# Altium project CPC-UNIFEI.PrjPcb (part 4 of 4)

## Sheet STM32_CONNECTORS.SchDoc
size A4; SheetNumber: 14; SheetTotal: 14
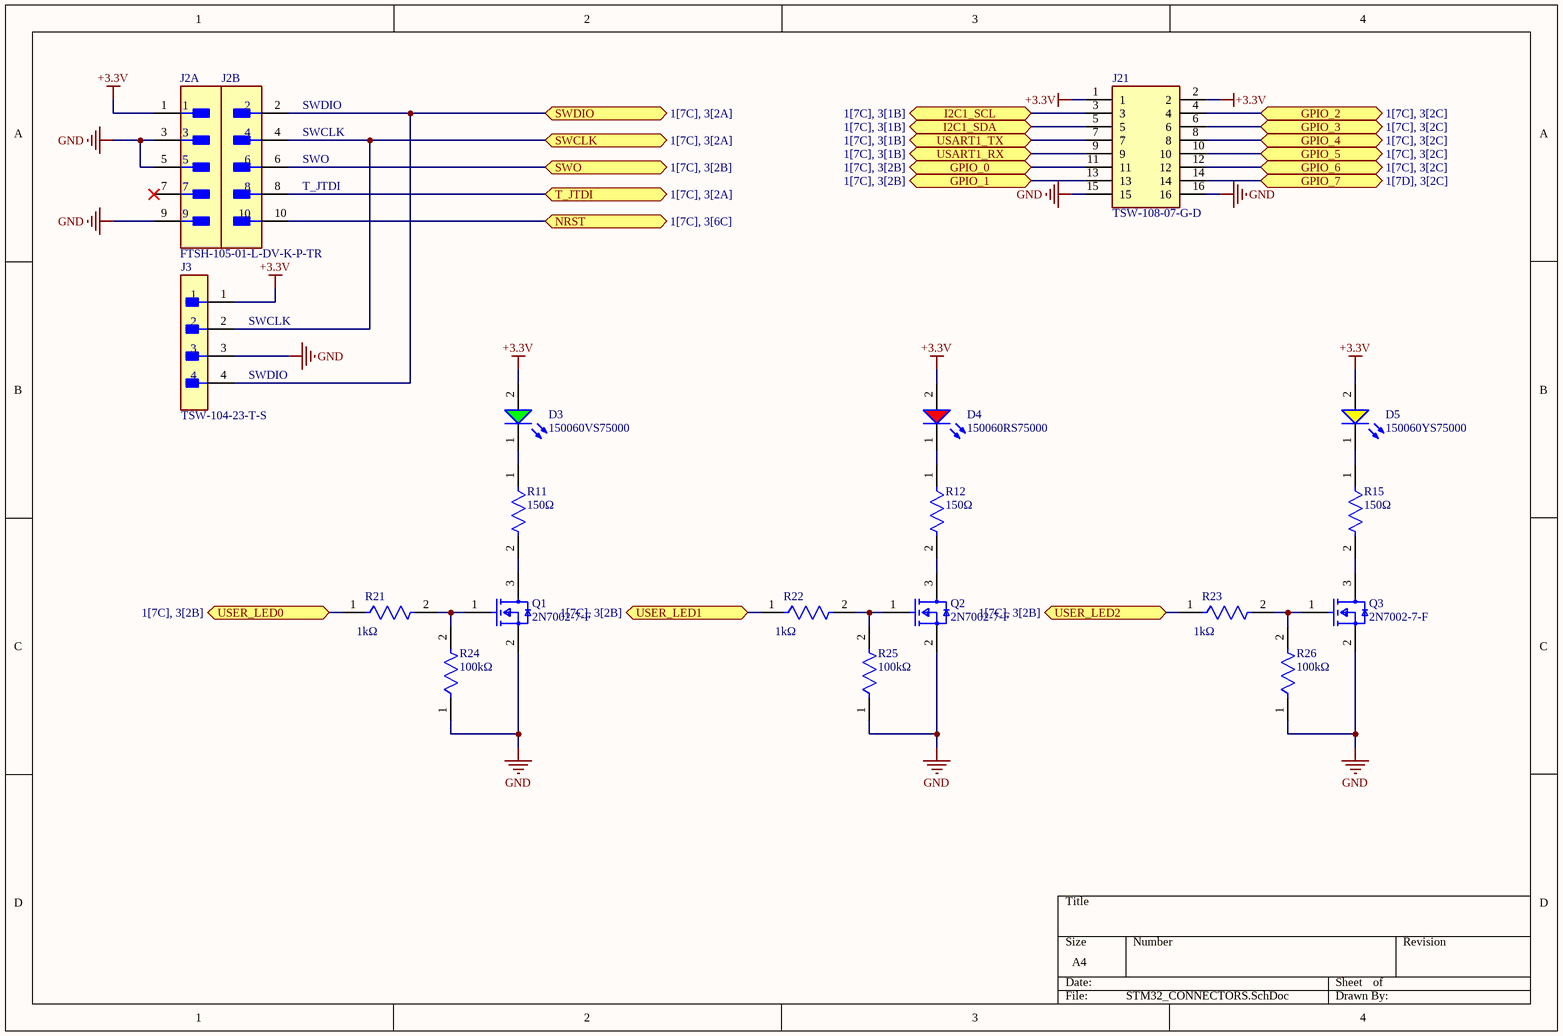
[diagram p13: STM32_CONNECTORS.SchDoc]

### Parts
D3  150060VS75000  [WL-SMCW_0603_150060xx75000]
D4  150060RS75000  [WL-SMCW_0603_150060xx75000]
D5  150060YS75000  [WL-SMCW_0603_150060xx75000]
J2  FTSH-105-01-L-DV-K-P-TR  [FP-FTSH-105-01-L-DV-K-P-T-MFG]  (parts A,B of 2)
J3  TSW-104-23-T-S  [FP-TSW-104-23-T-S-MFG]
J21  TSW-108-07-G-D  [HDRV16W64P254_2X8_2032X508X838P]
Q1  2N7002-7-F  [FP-SOT23-IPC_A]
Q2  2N7002-7-F  [FP-SOT23-IPC_A]
Q3  2N7002-7-F  [FP-SOT23-IPC_A]
R11  Resistance: 150Ω  [FP-CRCW0603-e3-IPC_B]  (hidden comment: CRCW0603150RFKEA)
R12  Resistance: 150Ω  [FP-CRCW0603-e3-IPC_B]  (hidden comment: CRCW0603150RFKEA)
R15  Resistance: 150Ω  [FP-CRCW0603-e3-IPC_B]  (hidden comment: CRCW0603150RFKEA)
R21  Resistance: 1kΩ  [FP-AC0603-IPC_B]  (hidden comment: AC0603FR-071KL)
R22  Resistance: 1kΩ  [FP-AC0603-IPC_B]  (hidden comment: AC0603FR-071KL)
R23  Resistance: 1kΩ  [FP-AC0603-IPC_B]  (hidden comment: AC0603FR-071KL)
R24  Resistance: 100kΩ  [FP-CRCW0603-e3-IPC_B]  (hidden comment: CRCW0603100KFKEC)
R25  Resistance: 100kΩ  [FP-CRCW0603-e3-IPC_B]  (hidden comment: CRCW0603100KFKEC)
R26  Resistance: 100kΩ  [FP-CRCW0603-e3-IPC_B]  (hidden comment: CRCW0603100KFKEC)

### Ports
GPIO_0 (bidir, see 1[7C], 3[2B]), GPIO_1 (bidir, see 1[7C], 3[2B]), GPIO_2 (bidir, see 1[7C], 3[2C]), GPIO_3 (bidir, see 1[7C], 3[2C]), GPIO_4 (bidir, see 1[7C], 3[2C]), GPIO_5 (bidir, see 1[7C], 3[2C]), GPIO_6 (bidir, see 1[7C], 3[2C]), GPIO_7 (bidir, see 1[7D], 3[2C]), I2C1_SCL (bidir, see 1[7C], 3[1B]), I2C1_SDA (bidir, see 1[7C], 3[1B]), NRST (bidir, see 1[7C], 3[6C]), SWCLK (bidir, see 1[7C], 3[2A]), SWDIO (bidir, see 1[7C], 3[2A]), SWO (bidir, see 1[7C], 3[2B]), T_JTDI (bidir, see 1[7C], 3[2A]), USART1_RX (bidir, see 1[7C], 3[1B]), USART1_TX (bidir, see 1[7C], 3[1B]), USER_LED0 (bidir, see 1[7C], 3[2B]), USER_LED1 (bidir, see 1[7C], 3[2B]), USER_LED2 (bidir, see 1[7C], 3[2B])

### Nets
+3.3V: D3.2(A) D4.2(A) D5.2(A) J2.1 J3.1 J21.1 J21.2
GND: J2.3 J2.5 J2.9 J3.3 J21.15 J21.16 Q1.2(S) Q2.2(S) Q3.2(S) R24.1 R25.1 R26.1
NRST: J2.10 ; port NRST
PA13: J2.2 J3.4 ; port SWDIO
PA14: J2.4 J3.2 ; port SWCLK
PA15: J2.8 ; port T_JTDI
PB0: R21.1 ; port USER_LED0
PB1: R22.1 ; port USER_LED1
PB2: R23.1 ; port USER_LED2
PB3: J2.6 ; port SWO
PB6: J21.3 ; port I2C1_SCL
PB7: J21.5 ; port I2C1_SDA
PB8: J21.11 ; port GPIO_0
PB9: J21.13 ; port GPIO_1
PB14: J21.7 ; port USART1_TX
PB15: J21.9 ; port USART1_RX
PE0: J21.4 ; port GPIO_2
PE1: J21.6 ; port GPIO_3
PE2: J21.8 ; port GPIO_4
PE3: J21.10 ; port GPIO_5
PE4: J21.12 ; port GPIO_6
PE5: J21.14 ; port GPIO_7
NetD3_1: D3.1(K) R11.1
NetD4_1: D4.1(K) R12.1
NetD5_1: D5.1(K) R15.1
NetQ1_1: Q1.1(G) R21.2 R24.2
NetQ1_3: Q1.3(D) R11.2
NetQ2_1: Q2.1(G) R22.2 R25.2
NetQ2_3: Q2.3(D) R12.2
NetQ3_1: Q3.1(G) R23.2 R26.2
NetQ3_3: Q3.3(D) R15.2

Not connected (* = marked no-connect by the designer): J2 7*

### Notes on the sheet
- (near J2) SWDIO
- (near J2) SWCLK
- (near J2) SWO
- (near J2) T_JTDI
- (near J3) SWCLK
- (near J3) SWDIO

### Library data of the parts
D3 = CMP-1426-00006-6: as D14-D17 on sheet DIGITAL_OUTPUTS_BLOCK_A; Packaging: Tape and Reel; REACH SVHC: Unknown; Width: 800µm; Max Operating Temperature: 85°C; Number of Pins: 2; RoHS: Compliant; Dominant Wavelength: 570nm; Min Operating Temperature: -40°C; Case Code (Imperial): 0603; Height: 700µm; Length: 1.6mm; Case Code (Metric): 1608; Case/Package: 0603; Max Reverse Voltage (DC): 5V; Mount: Surface Mount
D4 = CMP-1426-00001-3: NexarPartId: 29717776; Color: Red; Power Dissipation: 72mW; Max Reverse Voltage (DC): 5V; Peak Wavelength: 630nm; Viewing Angle: 140°; Forward Voltage: 2V; Luminous Intensity: 250mcd; Forward Current: 100mA; Dominant Wavelength: 625nm; Lens Style: Clear, Rectangular; Max Junction Temperature (Tj): 95°C; Test Current: 20mA; Mount: Surface Mount; Packaging: Tape and Reel; Case Code (Metric): 1608; Max Operating Temperature: 85°C; Case Code (Imperial): 0603; REACH SVHC: Unknown; Width: 800µm; Length: 1.6mm; Reverse Voltage: 5V; Height: 700µm; Case/Package: 0603; RoHS: Compliant; Wavelength: 625nm; Min Operating Temperature: -40°C
D5 = CMP-1426-00005-2: NexarPartId: 29687085; Wavelength: 590nm; Luminous Intensity: 120mcd; Peak Wavelength: 595nm; Forward Current: 100mA; Power Dissipation: 72mW; Color: Yellow; Forward Voltage: 2V; Test Current: 20mA; Reverse Voltage: 5V; Lens Style: Clear, Rectangular; Max Junction Temperature (Tj): 95°C; Viewing Angle: 140°; Case Code (Imperial): 0603; Height: 700µm; REACH SVHC: Unknown; Dominant Wavelength: 590nm; Min Operating Temperature: -40°C; Width: 800µm; Mount: Surface Mount; Packaging: Tape and Reel; Max Operating Temperature: 85°C; RoHS: Compliant; Max Reverse Voltage (DC): 5V; Case Code (Metric): 1608; Length: 1.6mm; Case/Package: 0603
J2 = CMP-2000-06292-2: CONN HEADER SMD 10POS 1.27MM; Gender: Male; Max Current Rating: 1.75A; Number of Contacts: 10; Contact Material: Bronze; Pitch: 1.27mm; Contact Plating: Gold; Orientation: Straight; RoHS Compliant: Yes; Housing Material: Polymer; Housing Color: Black; Length: 6.35mm; Number of Rows: 2; Lead Free: Lead Free; Max Operating Temperature: 125°C; Min Operating Temperature: -55°C; Radiation Hardening: No; Termination: Solder; Depth: 5.84mm; Packaging: Tape and Reel
J3 = CMP-02766-001388-1: CONN HEADER VERT 4POS 2.54MM; Number of Contacts: 4; Gender: Male; Connector Type: Male Pin; Max Voltage Rating (AC): 550V; Max Current Rating: 7.6A; Radiation Hardening: No; Lead Free: Lead Free; RoHS Compliant: Yes; Contact Material: Bronze; Number of Positions: 4; Housing Color: Black; Min Operating Temperature: -55°C; Mount: Through Hole; Number of Rows: 1; Orientation: Straight; Contact Mating Length: 0.23inch; Contact Type: Male Pin; REACH SVHC: No SVHC; Max Operating Temperature: 105°C; Color: Black; Pitch: 2.54mm; Length: 10.16mm; Series: TSW; Packaging: Bulk; Contact Plating: Tin; Package Quantity: 1; Termination: Solder; Housing Material: Polyester; Width: 2.54mm; Depth: 2.54mm
J21 = TSW-108-07-G-D: Connector; Manufacturer_Name: SAMTEC; Datasheet Link: https://suddendocs.samtec.com/catalog_english/tsw_th.pdf?_gl=1*vxrzbc*_ga*MTk4NDk3MDkyNi4xNjgxOTY2Mjg5*_ga_3KFNZC07WW*MTY4MzYyNDMyNC4zLjEuMTY4MzYyNDM4NC42MC4wLjA.; Height: 8.38mm; Manufacturer_Part_Number: TSW-108-07-G-D; Mouser Part Number: 200-TSW10807GD; Mouser Price/Stock: https://www.mouser.co.uk/ProductDetail/Samtec/TSW-108-07-G-D?qs=jyzYFa4oMQg0kuHhXNXiwg%3D%3D; Arrow Part Number: TSW-108-07-G-D; Arrow Price/Stock: https://www.arrow.com/en/products/tsw-108-07-g-d/samtec?region=nac
Q1-Q3 = CMP-2000-04929-2: as Q6-Q9 on sheet DIGITAL_OUTPUTS_BLOCK_A; Termination: SMD/SMT; Weight: 0.000282oz; Radiation Hardening: No; Max Operating Temperature: 150°C; On-State Resistance: 7.5R; Mount: Surface Mount; Current Rating: 115mA; Contact Plating: Tin; Lead Free: Lead Free; Min Operating Temperature: -55°C; Number of Pins: 3; REACH SVHC: No SVHC; Drain to Source Voltage (Vdss): 60V; Width: 1.3mm; Package Quantity: 3000; Length: 2.9mm; Case/Package: SOT-23; Number of Channels: 1; Dual Supply Voltage: 60V; Packaging: Tape and Reel; Height: 1mm; Voltage Rating (DC): 60V; Nominal Vgs: 2.5V; Continuous Drain Current (ID): 115mA; Voltage: 60V; Rds On Max: 7.5R
R11 R12 R15 = CMP-2000-03913-2: RES Thick Film, 150Ω, 1%, 0.1W, 100ppm/°C, 0603; Voltage Rating (DC): 75V; Max Power Dissipation: 100mW; Features: Automotive AEC-Q200; Weight: 7.1E-05oz; Number of Terminations: 2; Temperature Coefficient: 100ppm/°C; Military Standard: Not; Length: 1.55mm; Min Operating Temperature: -55°C; Termination: SMD/SMT; Tolerance: 1%; Composition: Thick Film; Depth: 0.85mm; Max Operating Temperature: 155°C; Width: 0.033inch; Lead Free: Lead Free; Height: 0.45mm; Case Code (Metric): 1608; Package Quantity: 10; Case Code (Imperial): 0603; Voltage Rating: 75V; Radiation Hardening: No; Contact Plating: Tin; Mount: Surface Mount; Packaging: Tape and Reel; Power Rating: 100mW; Case/Package: 0603
R21-R23 = CMP-2000-04828-3: RES 1kΩ 1.00% 0.1W 0603; Voltage Rating: 50V; Power Rating: 100mW; Tolerance: 1%; Temperature Coefficient: 100ppm/°C; Depth: 0.8mm; Case/Package: 0603; Size Code: 0603; Case Code (Metric): 1608; Height: 0.022inch; Series: AC; Width: 0.031inch; Construction: Rectangular; Length: 0.063inch; Case Code (Imperial): 0603; Package Quantity: 1; RoHS Compliant: Yes; Features: Moisture Resistant; Resistor Type: Thick Film; Max Power Dissipation: 100mW; Packaging: Tape and Reel; Termination: SMD/SMT; Ratings: AEC-Q200; Max Operating Temperature: 155°C; Min Operating Temperature: -55°C; Military Standard: Not; Lead Free: Lead Free; Number of Terminations: 2
R24-R26 = CMP-2000-03822-2: RES Thick Film, 100kΩ, 1%, 0.1W, 100ppm/°C, 0603; Power Rating: 100mW; Height: 0.02inch; Min Operating Temperature: -55°C; Length: 0.061inch; Temperature Coefficient: 100ppm/°C; Number of Terminations: 2; Packaging: Tape and Reel; Case Code (Imperial): 0603; Case/Package: 0603; Contact Plating: Tin; Radiation Hardening: No; Lead Free: Lead Free; Depth: 0.85mm; Case Code (Metric): 1608; Max Power Dissipation: 100mW; Features: Automotive AEC-Q200; Tolerance: 1%; Max Operating Temperature: 155°C; Composition: Thick Film; Military Standard: Not; Width: 0.033inch

## Nets that join several sheets
+3.3V: POWER (10 pins), USB (R124.2), STM32_IO (11 pins), DP83640 (21 pins), STM32_POWER (29 pins), DIGITAL_INPUTS (12 pins), FLASH (C136.1 C137.1 R198.2 U18.8), ADS8686S_BLOCK_A (R199.2), ADS8686S_BLOCK_B (7 pins), SDMMC (9 pins), STM32_CONNECTORS (7 pins)
+5V: POWER (6 pins), USB (U12.1), DIGITAL_OUTPUTS_BLOCK_A (8 pins), DIGITAL_OUTPUTS_BLOCK_B (8 pins), ADS8686S_BLOCK_B (C161.1 R65.1 R66.1)
GND: TOP_LEVEL (J4.2), POWER (33 pins), USB (11 pins), STM32_IO (10 pins), DP83640 (22 pins), STM32_POWER (29 pins), DIGITAL_INPUTS (12 pins), DIGITAL_OUTPUTS_BLOCK_A (8 pins), DIGITAL_OUTPUTS_BLOCK_B (8 pins), FLASH (C136.2 C137.2 U18.4 U18.9), ADS8686S_BLOCK_A (45 pins), ADS8686S_BLOCK_B (43 pins), SDMMC (C135.1 J15.G1 J15.G2 J15.P6), STM32_CONNECTORS (12 pins)
USB_FS_VBUS: POWER (R120.1 U10.1), USB (5 pins), STM32_IO (R3.1)
ADC_BUSY: STM32_IO (U1.80), ADS8686S_BLOCK_B (TP92.1 U19.67)
ADC_CONVST: STM32_IO (U1.81), ADS8686S_BLOCK_B (TP93.1 U19.68)
ADC_RESET: STM32_IO (U1.82), ADS8686S_BLOCK_B (C162.1 R254.2 TP95.1 U19.36)
NRST: STM32_IO (5 pins), STM32_CONNECTORS (J2.10)
PA0: STM32_IO (U1.34), DP83640 (TP58.1 U13.24)
PA1: STM32_IO (U1.35), DP83640 (TP68.1 U13.38)
PA2: STM32_IO (U1.36), DP83640 (R2.1 TP56.1 U13.30)
PA3: STM32_IO (U1.37), DP83640 (C108.1 R127.1 U13.29)
PA4: TOP_LEVEL (R16.1), STM32_IO (U1.40), ADS8686S_BLOCK_B (R252.1 TP94.1 U19.63)
PA5: TOP_LEVEL (R8.1), STM32_IO (U1.41), ADS8686S_BLOCK_B (TP91.1 U19.62)
PA6: STM32_IO (U1.42), ADS8686S_BLOCK_A (TP73.1 U19.57)
PA7: STM32_IO (U1.43), DP83640 (TP65.1 U13.40)
PA10: USB (J9.4), STM32_IO (U1.102)
PA13: STM32_IO (U1.105), STM32_CONNECTORS (J2.2 J3.4)
PA14: STM32_IO (U1.109), STM32_CONNECTORS (J2.4 J3.2)
PA15: STM32_IO (U1.110), STM32_CONNECTORS (J2.8)
PB0: STM32_IO (U1.46), STM32_CONNECTORS (R21.1)
PB1: STM32_IO (U1.47), STM32_CONNECTORS (R22.1)
PB2: STM32_IO (U1.48), STM32_CONNECTORS (R23.1)
PB3: STM32_IO (U1.133), STM32_CONNECTORS (J2.6)
PB4: TOP_LEVEL (R16.2), STM32_IO (U1.134)
PB6: STM32_IO (R4.1 U1.136), STM32_CONNECTORS (J21.3)
PB7: STM32_IO (R5.1 U1.137), STM32_CONNECTORS (J21.5)
PB8: STM32_IO (U1.139), STM32_CONNECTORS (J21.11)
PB9: STM32_IO (U1.140), STM32_CONNECTORS (J21.13)
PB10: TOP_LEVEL (R8.2), STM32_IO (U1.69)
PB11: STM32_IO (U1.70), DP83640 (TP55.1 U13.2)
PB12: STM32_IO (U1.73), DP83640 (TP51.1 U13.3)
PB13: STM32_IO (U1.74), DP83640 (TP52.1 U13.4)
PB14: STM32_IO (R6.1 U1.75), STM32_CONNECTORS (J21.7)
PB15: STM32_IO (R7.1 U1.76), STM32_CONNECTORS (J21.9)
PC1: STM32_IO (U1.27), DP83640 (TP57.1 U13.31)
PC2: STM32_IO (U1.28), DP83640 (TP50.1 U13.7)
PC3: STM32_IO (U1.29), ADS8686S_BLOCK_A (TP74.1 U19.56)
PC4: STM32_IO (U1.44), DP83640 (TP66.1 U13.46)
PC5: STM32_IO (U1.45), DP83640 (TP67.1 U13.45)
PC6: STM32_IO (U1.96), SDMMC (J15.CD2 R196.1)
PC7: STM32_IO (U1.97), SDMMC (J15.CD1 R195.1)
PC8: STM32_IO (U1.98), SDMMC (J15.P7 R193.1)
PC9: STM32_IO (U1.99), SDMMC (J15.P8 R194.1)
PC10: STM32_IO (U1.111), SDMMC (J15.P1 R190.1)
PC11: STM32_IO (U1.112), SDMMC (J15.P2 R191.1)
PC12: STM32_IO (U1.113), SDMMC (J15.P5)
PD0: STM32_IO (U1.114), DIGITAL_OUTPUTS_BLOCK_A (R162.1)
PD1: STM32_IO (U1.115), DIGITAL_OUTPUTS_BLOCK_A (R171.1)
PD2: STM32_IO (U1.116), SDMMC (J15.P3 R192.1)
PD3: STM32_IO (U1.117), DIGITAL_OUTPUTS_BLOCK_A (R163.1)
PD4: STM32_IO (U1.118), DIGITAL_OUTPUTS_BLOCK_A (R170.1)
PD5: STM32_IO (U1.119), DIGITAL_OUTPUTS_BLOCK_B (R178.1)
PD6: STM32_IO (U1.122), DIGITAL_OUTPUTS_BLOCK_B (R179.1)
PD7: STM32_IO (U1.123), ADS8686S_BLOCK_A (TP75.1 U19.55)
PD10: USB (R124.1 U12.3), STM32_IO (U1.79)
PE0: STM32_IO (U1.141), STM32_CONNECTORS (J21.4)
PE1: STM32_IO (U1.142), STM32_CONNECTORS (J21.6)
PE2: STM32_IO (U1.1), STM32_CONNECTORS (J21.8)
PE3: STM32_IO (U1.2), STM32_CONNECTORS (J21.10)
PE4: STM32_IO (U1.3), STM32_CONNECTORS (J21.12)
PE5: STM32_IO (U1.4), STM32_CONNECTORS (J21.14)
PE7: STM32_IO (U1.58), DIGITAL_INPUTS (U16.5)
PE8: STM32_IO (U1.59), DIGITAL_INPUTS (U17.4)
PE9: STM32_IO (U1.60), DIGITAL_INPUTS (U17.5)
PF0: STM32_IO (U1.10), FLASH (U18.5)
PF1: STM32_IO (U1.11), FLASH (U18.2)
PF2: STM32_IO (U1.12), FLASH (U18.3)
PF3: STM32_IO (U1.13), FLASH (U18.7)
PF4: STM32_IO (U1.14), FLASH (U18.6)
PF11: POWER (C95.1 R119.2), STM32_IO (U1.49)
PF12: POWER (C93.1 R114.2), STM32_IO (U1.50)
PF13: STM32_IO (U1.53), DIGITAL_INPUTS (U14.4)
PF14: STM32_IO (U1.54), DIGITAL_INPUTS (U14.5)
PF15: STM32_IO (U1.55), DIGITAL_INPUTS (U15.4)
PG0: STM32_IO (U1.56), DIGITAL_INPUTS (U15.5)
PG1: STM32_IO (U1.57), DIGITAL_INPUTS (U16.4)
PG9: STM32_IO (U1.124), DIGITAL_OUTPUTS_BLOCK_B (R186.1)
PG10: STM32_IO (U1.125), DIGITAL_OUTPUTS_BLOCK_B (R187.1)
PG12: STM32_IO (U1.127), FLASH (R198.1 U18.1)
POWER_INPUT: TOP_LEVEL (J4.1), POWER (8 pins)
USB_FS_N: USB (IC1.3), STM32_IO (U1.103)
USB_FS_P: USB (IC1.1), STM32_IO (U1.104)

## Assembly variants
Variant of CPC-UNIFEI: not fitted C154 C155 C156 C157 C158 C159 C160 R65 R199 R246 R250 TP43 TP44 TP45 TP46 TP47 TP48 TP49 TP50 TP51 TP52 TP53 TP54 TP55 TP56 TP57 TP58 TP63 TP64 TP65 TP66 TP67 TP68 TP73 TP74 TP75 TP90 TP91 TP92 TP93 TP94 TP95 TP96 TP97 TP98 U20